# EAGLE design Driver (EAGLE 6.4)
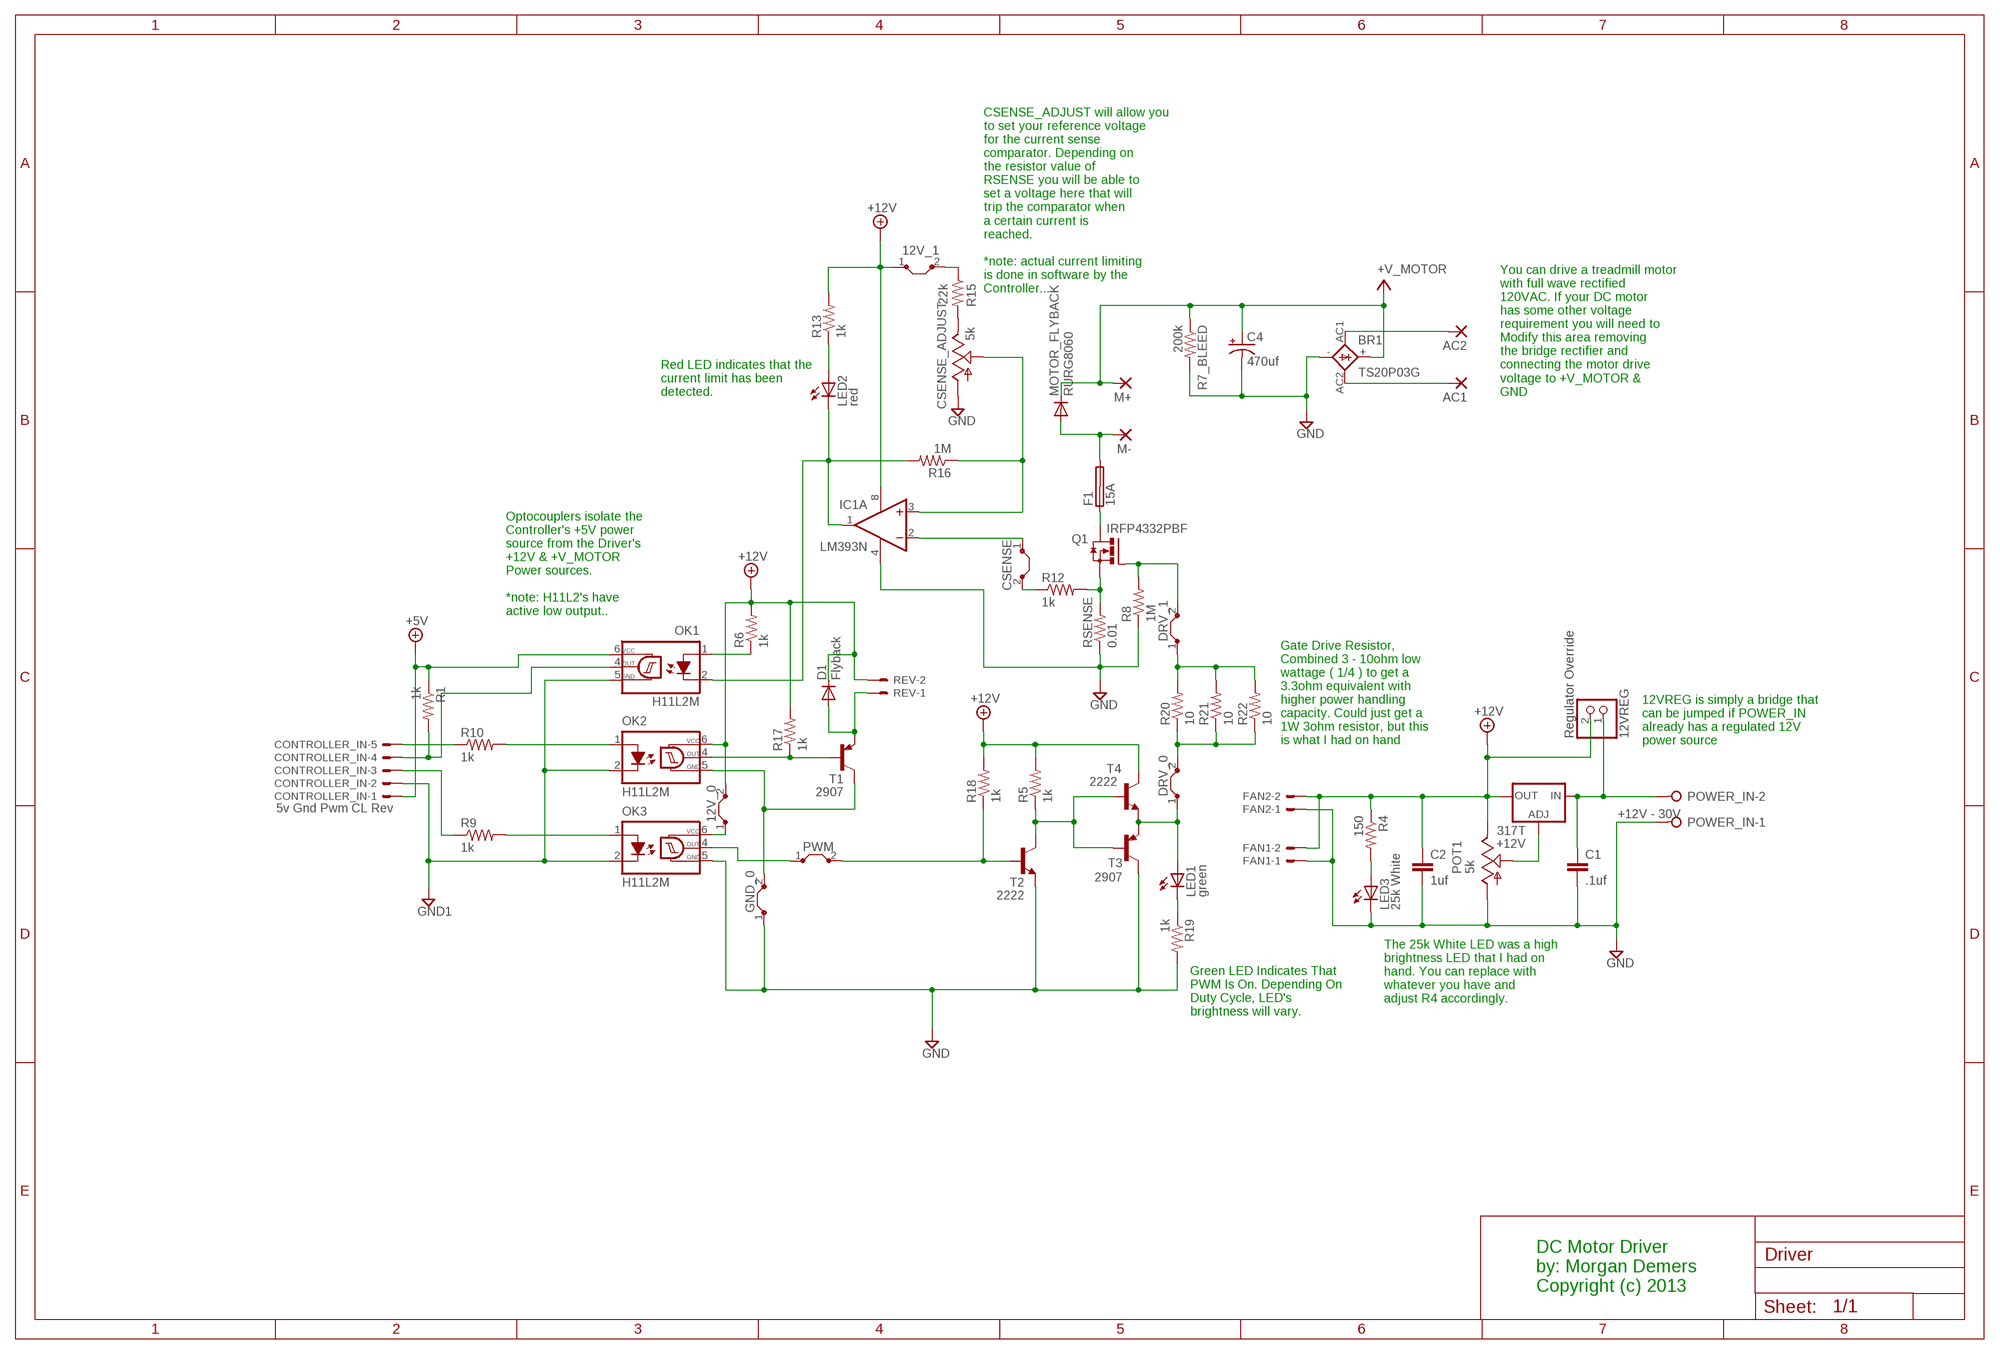
[diagram p0: schematic, sheet 1]

## Parts
12V_0  J10MM  [10]
12V_1  J5MM  [05]
12VREG  Regulator Override  PINHD-1X2  [1X02]
317T  +12V  LM317TS  [317TS]
AC1  WIREPAD4,16O1,6  [4,16O1,6]
AC2  WIREPAD4,16O1,6  [4,16O1,6]
BR1  TS20P03G  FB32  [FB32]
C1  .1uf  C2,5-3  [C2.5-3]
C2  1uf  C2,5-3  [C2.5-3]
C4  470uf  CPOL-USE10-22.5  [EB22,5D]
CONTROLLER_IN  5v Gnd Pwm CL Rev  22-23-2051  [22-23-2051]
CSENSE  J7MM  [07]
CSENSE_ADJUST  5k  TRIM_US-B25P  [B25P]
D1  Flyback  DIODE-D-2.5  [D-2.5]
DRV_0  J5MM  [05]
DRV_1  J12MM  [12]
F1  15A  SHK20L  [SHK20L]
FAN1  22-23-2021  [22-23-2021]
FAN2  22-23-2021  [22-23-2021]
GND_0  J7MM  [07]
IC1  LM393N  [DIL08]
LED1  green  LED3MM  [LED3MM]
LED2  red  LED3MM  [LED3MM]
LED3  25k White  LED3MM  [LED3MM]
M+  WIREPAD4,16O1,6  [4,16O1,6]
M-  WIREPAD4,16O1,6  [4,16O1,6]
MOTOR_FLYBACK  RURG8060  DIODE-TO220V  [TO220ACS]
OK1  H11L2M  [DIL06]
OK2  H11L2M  [DIL06]
OK3  H11L2M  [DIL06]
POT1  5k  TRIM_US-B25P  [B25P]
POWER_IN  +12V - 30V  W237-02P  [W237-132]
PWM  J5MM  [05]
Q1  IRFP4332PBF  IRFP240  [TO247BV]
R1  1k  R-US_0204/7  [0204/7]
R4  150  R-US_0204/2V  [0204V]
R5  1k  R-US_0204/2V  [0204V]
R6  1k  R-US_0204/2V  [0204V]
R7_BLEED  200k  R-US_0207/10  [0207/10]
R8  1M  R-US_0204/2V  [0204V]
R9  1k  R-US_0204/2V  [0204V]
R10  1k  R-US_0204/2V  [0204V]
R12  1k  R-US_0204/2V  [0204V]
R13  1k  R-US_0204/2V  [0204V]
R15  22k  R-US_0204/2V  [0204V]
R16  1M  R-US_0204/5  [0204/5]
R17  1k  R-US_0204/5  [0204/5]
R18  1k  R-US_0204/7  [0204/7]
R19  1k  R-US_0204/2V  [0204V]
R20  10  R-US_0204/2V  [0204V]
R21  10  R-US_0204/2V  [0204V]
R22  10  R-US_0204/2V  [0204V]
REV  22-23-2021  [22-23-2021]
RSENSE  0.01  R-US_0204/2V  [0204V]
T1  2907  MPSA56  [TO92-CBE]
T2  2222  -NPN-TO92-EBC  [TO92-EBC]
T3  2907  MPSA56  [TO92-CBE]
T4  2222  -NPN-TO92-EBC  [TO92-EBC]

## Nets
+5V: CONTROLLER_IN.1 OK1.6(VCC) R1.1
+12V: 12V_0.2 12V_1.1 12VREG.2 317T.2(OUT) C2.1 D1.C FAN1.2 FAN2.2 IC1.8(P:V+) OK2.6(VCC) POT1.E R4.1 R5.2 R6.2 R13.2 R17.2 R18.2 REV.2 T4.C
GND: BR1.- C1.2 C2.2 C4.- CSENSE_ADJUST.A FAN1.1 FAN2.1 GND_0.1 IC1.4(P:V-) LED3.K(C) OK3.5(GND) POT1.A POWER_IN.1 R7_BLEED.2 R8.1 R19.2 RSENSE.1 T2.E T3.C
GND1: CONTROLLER_IN.2 OK1.5(GND) OK2.2(C) OK3.2(C)
N$1: OK2.1(A) R10.2
N$2: OK3.4(OUT) PWM.1
N$3: CSENSE.1 IC1.2(A:-IN)
S$1: CONTROLLER_IN.3 R9.1
S$2: PWM.2 R18.1 T2.B
S$4: Q1.S R12.2 RSENSE.2
S$6: 317T.1(ADJ) POT1.S
S$7: CONTROLLER_IN.5 R10.1
S$8: CONTROLLER_IN.4 OK1.4(OUT) R1.2
S$9: R5.1 T2.C T3.B T4.B
S$10: 12V_1.2 R15.1
S$11: LED3.A R4.2
S$12: IC1.1(A:OUT) LED2.K(C) OK1.2(C) R16.2
S$13: DRV_0.2 R20.1 R21.1 R22.1
S$14: OK2.4(OUT) R17.1 T1.B
S$16: DRV_1.2 Q1.G R8.2
S$20: F1.1A Q1.D
S$21: AC1.1(P) BR1.AC2
S$22: OK1.1(A) R6.1
S$23: AC2.1(P) BR1.AC1
S$25: F1.2A M-.1(P) MOTOR_FLYBACK.A
S$26: 12V_0.1 OK3.6(VCC)
S$27: CSENSE_ADJUST.E R15.2
S$32: OK3.1(A) R9.2
S$34: CSENSE.2 R12.1
S$45: CSENSE_ADJUST.S IC1.3(A:+IN) R16.1
S$50: LED1.K(C) R19.1
S$51: LED2.A R13.1
S$52: DRV_1.1 R20.2 R21.2 R22.2
S$54: 12VREG.1 317T.3(IN) C1.1 POWER_IN.2
S$129: DRV_0.1 LED1.A T3.E T4.E
S$171: D1.A REV.1 T1.E
S$448: GND_0.2 OK2.5(GND) T1.C
V+: BR1.+ C4.+ M+.1(P) MOTOR_FLYBACK.C R7_BLEED.1 ; supply symbol labelled +V_MOTOR
Unconnected: F1.1B F1.2B IC1.5(B:+IN) IC1.6(B:-IN) IC1.7(B:OUT)

## Notes on the sheet
- CSENSE_ADJUST will allow you
  to set your reference voltage
  for the current sense 
  comparator. Depending on
  the resistor value of 
  RSENSE you will be able to
  set a voltage here that will
  trip the comparator when
  a certain current is 
  reached.
  
  *note: actual current limiting
  is done in software by the
  Controller...
- Red LED indicates that the
  current limit has been 
  detected.
- You can drive a treadmill motor
  with full wave rectified
  120VAC. If your DC motor
  has some other voltage 
  requirement you will need to
  Modify this area removing
  the bridge rectifier and 
  connecting the motor drive
  voltage to +V_MOTOR &
  GND
- Optocouplers isolate the
  Controller's +5V power 
  source from the Driver's
  +12V & +V_MOTOR
  Power sources.
  
  *note: H11L2's have 
  active low output..
- Gate Drive Resistor,
  Combined 3 - 10ohm low
  wattage ( 1/4 ) to get a
  3.3ohm equivalent with
  higher power handling
  capacity. Could just get a
  1W 3ohm resistor, but this
  is what I had on hand
- 12VREG is simply a bridge that
  can be jumped if POWER_IN
  already has a regulated 12V 
  power source
- The 25k White LED was a high
  brightness LED that I had on
  hand. You can replace with
  whatever you have and 
  adjust R4 accordingly.
- Green LED Indicates That
  PWM Is On. Depending On
  Duty Cycle, LED's
  brightness will vary.
- DC Motor Driver
  by: Morgan Demers
  Copyright (c) 2013

## Library data of the parts
12V_0 12V_1 CSENSE DRV_0 DRV_1 GND_0 PWM = jumper:J: Bridge
12VREG = pinhead:PINHD-1X2: PIN HEADER
317T = v-reg:LM317TS: VOLTAGE REGULATOR
AC1 AC2 M+ M- = wirepad:WIREPAD: Wire PAD connect wire on PCB
BR1 = rectifier:FB32: FAGOR RECTIFIER grid 1 x 10,2 x 7,5 mm
C1 C2 = capacitor-wima:C: CAPACITOR naming: grid - package width
C4 = rcl:CPOL-US: POLARIZED CAPACITOR, American symbol
CONTROLLER_IN = con-molex:22-23-2051: .100" (2.54mm) Center Header - 5 Pin; MF: MOLEX; MPN: 22-23-2051; OC_FARNELL: 1462952; OC_NEWARK: 38C9178
CSENSE_ADJUST POT1 = pot:TRIM_US-: POTENTIOMETER
D1 MOTOR_FLYBACK = diode:DIODE-: DIODE
F1 = fuse:SHK20L: FUSE HOLDER 5 x 20 mm, SH contact, SHH1 Schukat, E1073 Buerklin; OC_FARNELL: unknown; OC_NEWARK: unknown
FAN1 FAN2 REV = con-molex:22-23-2021: .100" (2.54mm) Center Header - 2 Pin; MF: MOLEX; MPN: 22-23-2021; OC_FARNELL: 1462926; OC_NEWARK: 25C3832
IC1 = linear:LM393: COMPARATOR
LED1-LED3 = led:LED: LED OSRAM: - CHIPLED LG R971, LG N971, LY N971, LG Q971, LY Q971, LO R971, LY R971 LH N974, LH R974 LS Q976, LO Q976, LY Q976 LO Q996 - Hyper CHIPLED LW Q18S LB Q993, LB Q99A, LB R99A - SideLED LS A670, LO A670, LY A670, LG A670, LP A670 LB A673, LV A673, LT A673, LW A673 LH A674 LY A675 LS A676, LA A676, LO A676, LY A676, LW A676 LS A679, LY A679, LG A679 - Hyper Micro SIDELED® LS Y876, LA Y876, LO Y876, LY Y876 LT Y87S - SmartLED LW L88C, LW L88S LB L89C, LB L89S, LG L890 LS L89K, LO L89K, LY L89K LS L896, LA L896, LO L896, LY L896 - TOPLED LS T670, LO T670, LY T670, LG T670, LP T670 LSG T670, LSP T670, LSY T670, LOP T670, LYG T670 LG T671, LOG T671, LSG T671 LB T673, LV T673, LT T673, LW T673 LH T674 LS T676, LA T676, LO T676, LY T676, LB T676, LH T676, LSB T676, LW T676 LB T67C, LV T67C, LT T67C, LS T67K, LO T67K, LY T67K, LW E67C LS E67B, LA E67B, LO E67B, LY E67B, LB E67C, LV E67C, LT E67C LW T67C LS T679, LY T679, LG T679 LS T770, LO T770, LY T770, LG T770, LP T770 LB T773, LV T773, LT T773, LW T773 LH T774 LS E675, LA E675, LY E675, LS T675 LS T776, LA T776, LO T776, LY T776, LB T776 LHGB T686 LT T68C, LB T68C - Hyper Mini TOPLED® LB M676 - Mini TOPLED Santana® LG M470 LS M47K, LO M47K, LY M47K Source: http://www.osram.convergy.de LUXEON: - LUMILED® LXK2-PW12-R00, LXK2-PW12-S00, LXK2-PW14-U00, LXK2-PW14-V00 LXK2-PM12-R00, LXK2-PM12-S00, LXK2-PM14-U00 LXK2-PE12-Q00, LXK2-PE12-R00, LXK2-PE12-S00, LXK2-PE14-T00, LXK2-PE14-U00 LXK2-PB12-K00, LXK2-PB12-L00, LXK2-PB12-M00, LXK2-PB14-N00, LXK2-PB14-P00, LXK2-PB14-Q00 LXK2-PR12-L00, LXK2-PR12-M00, LXK2-PR14-Q00, LXK2-PR14-R00 LXK2-PD12-Q00, LXK2-PD12-R00, LXK2-PD12-S00 LXK2-PH12-R00, LXK2-PH12-S00 LXK2-PL12-P00, LXK2-PL12-Q00, LXK2-PL12-R00 Source: www.luxeon.com KINGBRIGHT: KA-3528ASYC Source: www.kingbright.com
OK1-OK3 = optocoupler:H11L*M: 6-Pin DIP Optocoupler Source: http://www.fairchildsemi.com/ds/H1/H11L2-M.pdf; MF: FAIRCHILD SEMICONDUCTOR; MPN: H11L2M; OC_FARNELL: 1021231; OC_NEWARK: 72K8645
POWER_IN = con-wago-508:W237-02P: WAGO SREW CLAMP; OC_FARNELL: unknown; OC_NEWARK: unknown
Q1 = transistor-power:IRFP240: HEXFET Power MosFet Source: http://www.irf.com/
R1 R4-R6 R7_BLEED R8-R10 R12 R13 R15-R22 RSENSE = resistor:R-US_: RESISTOR, American symbol
T1 T3 = transistor-pnp:MPSA56*: PNP Transistror Source: http://www.fairchildsemi.com/ds/MM/MMBTA56.pdf
T2 T4 = transistor:*-NPN-: NPN Transistror BF959 corrected 2008.03.06

## Board
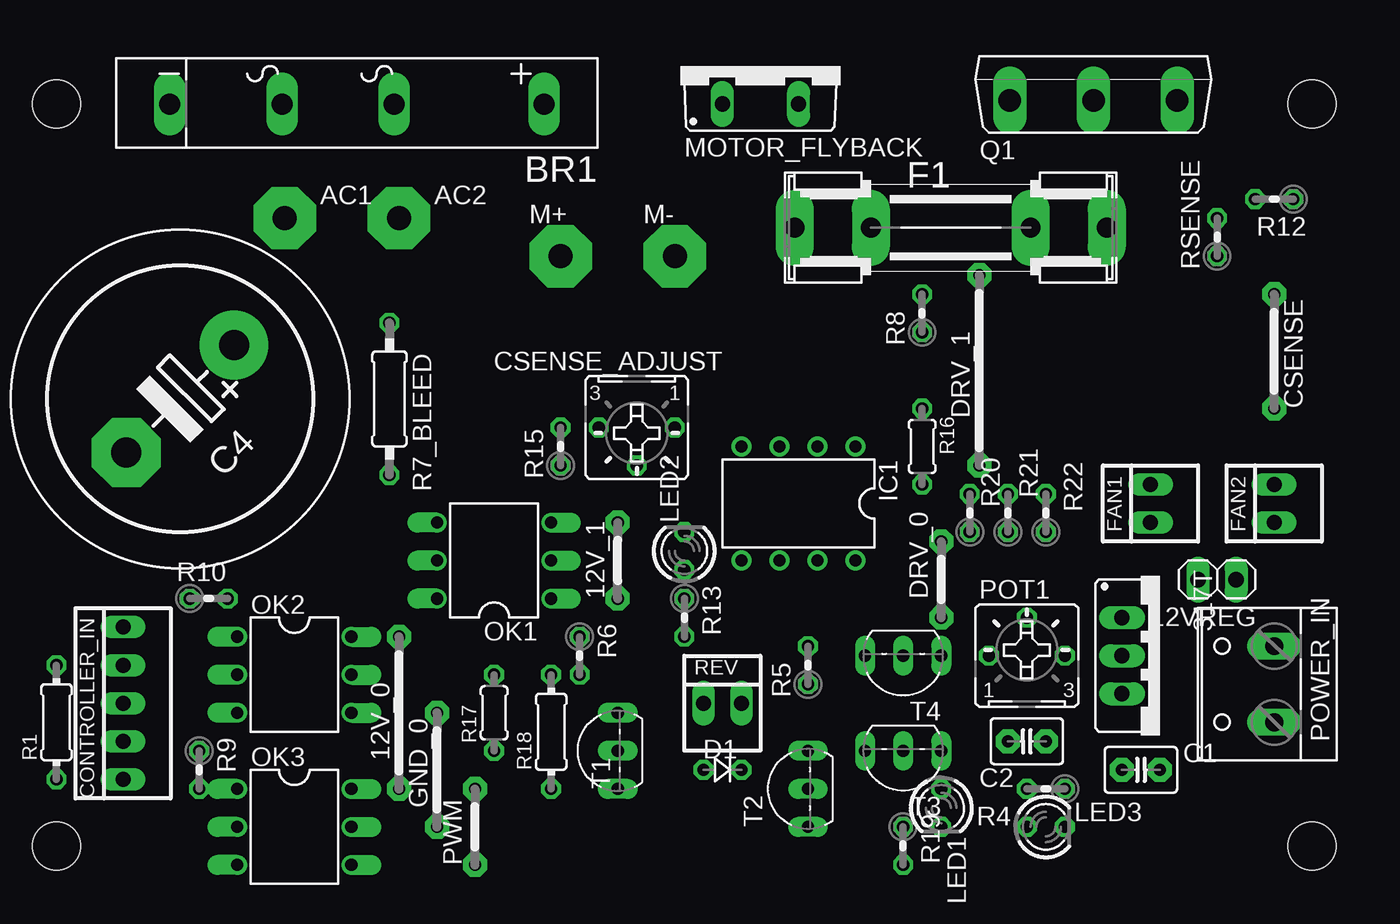
[diagram p1: board, top side]
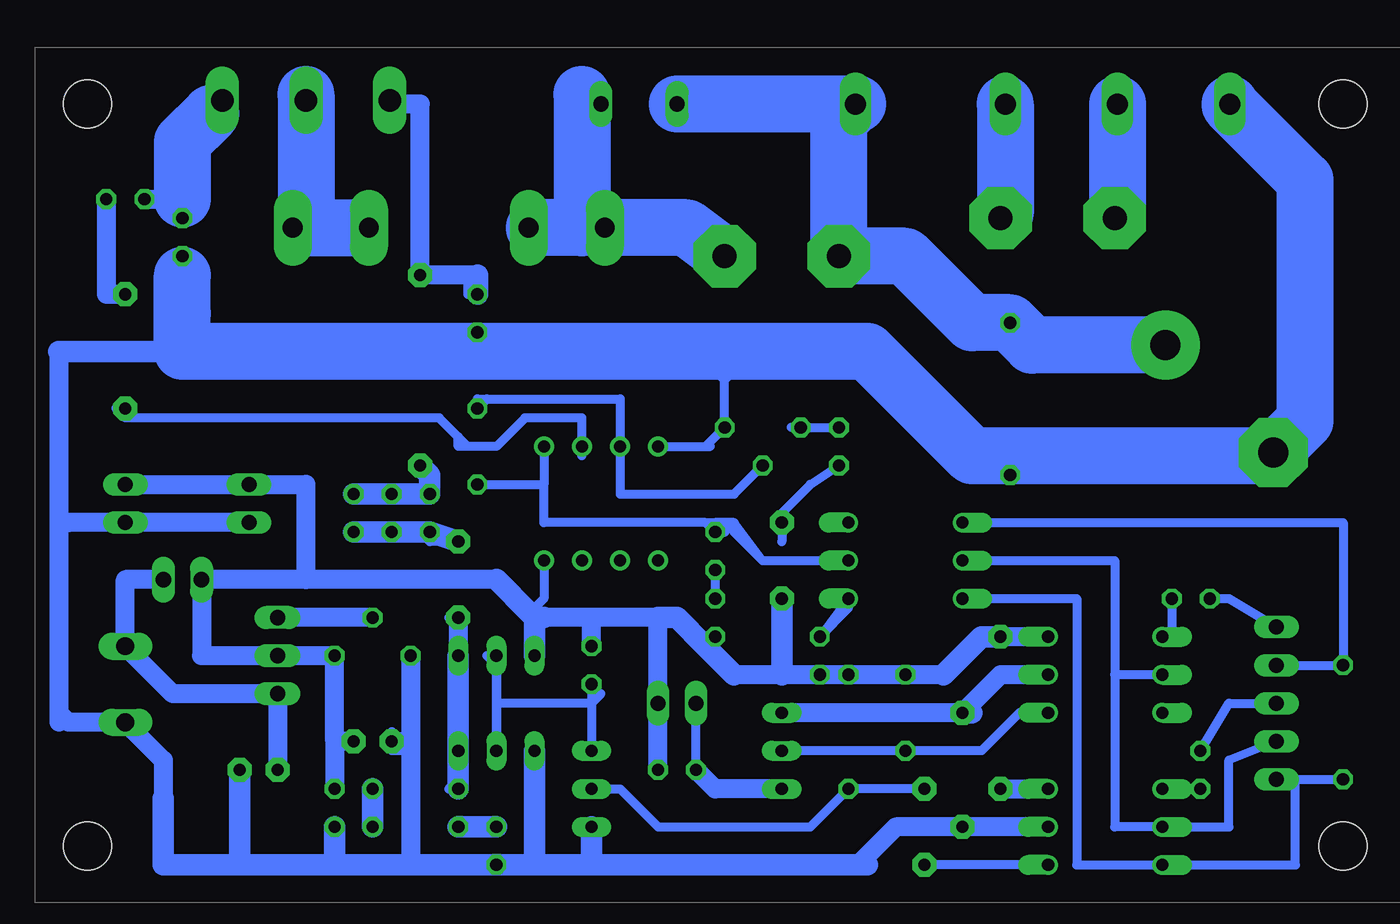
[diagram p2: board, bottom side, seen from below]

No outline drawn. Coordinates in mm, seen from the top.
Copper layers (1*16): Top 0.035mm / dielectric 1.5mm / Bottom 0.035mm
Design rules "default": minimum track width 10mil, minimum drill 24mil, track to track 12mil, track to pad 12mil, pad to pad 12mil, via to via 12mil, smd to smd 8mil, copper to edge 40mil, drill to drill 8mil, minimum pad ring 10mil, minimum via ring 8mil, stop-mask expansion 4mil, vias tented up to drill 0mil, thermal gap 10mil
Holes 3.2 mm at 3.81,53.34 87.63,53.34 87.63,3.81 3.81,3.81

### Footprints (pad centres in the part's own frame; a part is rotated, then mirrored left to right if it is on the bottom)
10 = drill 0.813 pad 1.6 octagon: 1 -5.08,0; 2 5.08,0
05 = drill 0.813 pad 1.6 octagon: 1 -2.54,0; 2 2.54,0
1X02 = drill 1.016 long: 1 -1.27,0; 2 1.27,0
317TS = drill 1.016 long: 1 -2.54,-2.54; 2 0,-2.54; 3 2.54,-2.54
4,16O1,6 = drill 1.6 pad 4.166 octagon: 1 0,0
FB32 = drill 1.397 long: + -13.5,0; - 11.494,0; AC1 -3.492,0; AC2 4.001,0
C2.5-3 = drill 0.813 pad 1.6 octagon: 1 -1.27,0; 2 1.27,0
EB22,5D = drill 2.007 pad 4.597: + -5.08,0 | drill 2.007 pad 4.597 octagon: - 5.08,0
22-23-2051 = drill 1 long: 1 -5.08,0; 2 -2.54,0; 3 0,0; 4 2.54,0; 5 5.08,0
07 = drill 0.813 pad 1.6 octagon: 1 -3.81,0; 2 3.81,0
B25P = drill 0.813 octagon: A -2.54,0; E 2.54,0; S 0,2.54
D-2.5 = drill 0.813 octagon: A 1.27,0; C -1.27,0
12 = drill 0.813 pad 1.6 octagon: 1 -6.35,0; 2 6.35,0
SHK20L = drill 1.321 pad 2.54 long: 1A -10.414,0; 1B -5.334,0; 2A 10.414,0; 2B 5.334,0
22-23-2021 = drill 1 long: 1 -1.27,0; 2 1.27,0
DIL08 = drill 0.813 pad 1.27: 1 -3.81,-3.81; 2 -1.27,-3.81; 3 1.27,-3.81; 4 3.81,-3.81; 5 3.81,3.81; 6 1.27,3.81; 7 -1.27,3.81; 8 -3.81,3.81
LED3MM = drill 0.813 octagon: A -1.27,0; K 1.27,0
TO220ACS = drill 1.016 long: A 2.54,-2.54; C -2.54,-2.54
DIL06 = drill 0.813 offset: 1 -2.54,-3.81; 2 0,-3.81; 3 2.54,-3.81; 4 2.54,3.81; 5 0,3.81; 6 -2.54,3.81
W237-132 = drill 1.194 long: 1 -2.54,-0.635; 2 2.54,-0.635
TO247BV = drill 1.499 long: D 0,-2.921; G -5.588,-2.921; S 5.588,-2.921
0204/7 = drill 0.813 octagon: 1 -3.81,0; 2 3.81,0
0204V = drill 0.813 octagon: 1 -1.27,0; 2 1.27,0
0207/10 = drill 0.813 octagon: 1 -5.08,0; 2 5.08,0
0204/5 = drill 0.813 octagon: 1 -2.54,0; 2 2.54,0
TO92-CBE = drill 0.813 long: B 0,0; C 2.54,0; E -2.54,0
TO92-EBC = drill 0.813 long: B 0,-1.27; C 2.54,-1.27; E -2.54,-1.27

### Placement (x,y rotation side)
12V_0  26.67,12.7 90 top
12V_1  41.27,22.86 90 top
12VREG  81.28,21.59 180 top
317T  77.47,16.51 270 top
AC1  19.05,45.72 0 top
AC2  26.67,45.72 0 top
BR1  22.86,53.34 180 top
C1  76.2,8.89 0 top
C2  68.58,10.79 180 top
C4  12.06,33.66 225 top
CONTROLLER_IN  8.26,13.34 90 top
CSENSE  85.09,36.83 90 top
CSENSE_ADJUST  42.55,31.75 180 top
D1  48.26,8.89 180 top
DRV_0  62.87,21.59 90 top
DRV_1  65.41,35.56 90 top
F1  63.5,45.09 180 top
FAN1  76.83,26.67 90 top
FAN2  85.09,26.67 90 top
GND_0  29.21,8.89 90 top
IC1  53.34,26.67 180 top
LED1  62.87,6.35 270 top
LED2  45.72,23.5 90 top
LED3  69.85,5.08 0 top
M+  37.47,43.18 0 top
M-  45.09,43.18 0 top
MOTOR_FLYBACK  50.8,55.88 0 top
OK1  33.02,22.86 90 top
OK2  19.68,15.24 270 top
OK3  19.68,5.08 270 top
POT1  68.58,16.51 0 top
POWER_IN  84.45,14.61 90 top
PWM  31.75,5.08 90 top
Q1  73.03,56.52 0 top
R1  3.81,12.06 90 top
R4  69.85,7.62 180 top
R5  53.98,15.88 90 top
R6  38.73,16.51 270 top
R7_BLEED  26.04,33.66 270 top
R8  61.59,39.37 90 top
R9  13.34,8.89 270 top
R10  13.97,20.32 0 top
R12  85.09,46.99 180 top
R13  45.72,19.05 270 top
R15  37.47,30.48 90 top
R16  61.59,30.48 270 top
R17  33.02,12.7 90 top
R18  36.83,11.43 90 top
R19  60.33,3.81 270 top
R20  64.77,26.04 90 top
R21  67.31,26.04 90 top
R22  69.85,26.04 90 top
REV  48.26,13.34 0 top
RSENSE  81.28,44.45 90 top
T1  41.27,10.16 90 top
T2  52.7,7.62 90 top
T3  60.33,10.16 180 top
T4  60.33,15.24 180 top

### Tracks (layer width: path | path; a pad name or v marks a point on that pad's centre or on a via)
+5V
  Bottom 0.61: CONTROLLER_IN.1 6.99,8.26 | OK1.6 21.59,20.32 21.59,2.54 6.99,2.54 6.99,8.26 | 6.99,8.26 R1.1
+12V
  Bottom 0.61: 46.35,17.14 R13.2 | T4.C 57.78,18.41 57.15,19.05 | IC1.8 57.15,20.32 58.1,19.37
  Bottom 1.27: 30.48,15.24 R17.2 R18.2 R6.2 41.27,15.24 44.45,15.24 | 53.98,19.05 49.53,19.05 REV.2 D1.C | 53.98,19.05 57.15,19.05 | R5.2 53.98,19.05 | 60.33,21.59 73.03,21.59 | 85.72,27.94 FAN2.2 FAN1.2 73.03,27.94 73.03,21.59 | 73.03,21.59 12VREG.2 80.01,16.51 317T.2 POT1.E 71.12,10.79 | 71.12,10.79 R4.1 | C2.1 71.12,10.79 | OK2.6 12V_0.2
  Bottom 1.422: 57.15,19.05 57.78,19.05 | 57.78,19.05 T4.C | 60.33,21.59 58.1,19.37 57.78,19.05 | 30.48,15.24 27.94,17.78 12V_0.2 | 41.27,15.24 12V_1.1 | 49.53,19.05 48.26,19.05 46.35,17.14 44.45,15.24
-V_MOTOR
  Bottom 3.81: 54.61,53.98 54.61,45.09 | 54.61,45.09 57.78,45.09 | 45.09,43.18 47.62,45.09 54.61,45.09
GND
  Bottom 0.406: 46.04,30.48 46.04,30.8
  Bottom 0.61: C4.- 8.67,30.06 8.89,29.84 | R7_BLEED.2 27.3,28.57 28.57,29.84 | R8.1 60.96,38.1 59.69,36.83 | RSENSE.1 81.28,39.37 | 89.53,25.4 FAN2.1 FAN1.1 | CSENSE_ADJUST.A 45.09,36.83 | 45.09,34.92 45.72,35.56 | 66.04,10.16 67.31,10.16 67.31,11.43 66.04,10.16 | 66.04,10.16 66.04,15.24 | CSENSE_ADJUST.A 45.09,34.92 | 45.09,34.92 44.45,35.56 44.45,36.83 | T2.E 53.98,3.17 53.34,2.54 58.42,2.54 | T3.C 57.78,3.17 58.42,2.54 | 58.42,2.54 60.96,2.54 | 46.35,30.48 46.04,30.8 CSENSE_ADJUST.A | IC1.4 46.04,30.48
  Bottom 1.27: 89.53,36.83 89.53,25.4 89.53,12.7 | 89.53,12.7 89.53,12.06 | 89.53,12.7 88.9,12.06 POWER_IN.1 82.55,9.53 82.55,6.35 | 36.2,2.54 33.66,5.08 GND_0.1 OK3.5 | POT1.A 66.04,15.24 66.04,10.79 | 66.04,10.79 66.04,10.16 66.04,2.54 | C2.2 66.04,10.79
  Bottom 1.422: 77.47,2.54 82.55,2.54 82.55,6.35 82.55,6.99 | 77.47,2.54 71.12,2.54 | 71.12,2.54 66.04,2.54 60.96,2.54 R19.2 58.42,2.54 57.78,2.54 | 57.78,2.54 53.98,2.54 | 53.98,2.54 53.34,2.54 36.2,2.54 35.56,2.54 | T2.E 53.98,2.54 | C1.2 77.47,2.54 | LED3.K 71.12,2.54 | 89.53,36.83 81.28,36.83 | T3.C 57.78,2.54
  Bottom 3.81: 81.28,41.91 81.28,39.37 81.28,36.83 59.69,36.83 44.45,36.83 35.56,36.83 28.57,29.84 8.89,29.84 8.26,29.84 | BR1.- 11.37,53.28 6.35,48.26 6.35,32.19 C4.-
GND1
  Bottom 0.61: 19.05,15.24 19.05,22.86 OK1.5 | 19.05,15.24 19.05,5.08 OK3.2 11.43,5.08 11.43,9.53 CONTROLLER_IN.2 | OK2.2 19.05,15.24
N$1
  Bottom 0.61: R10.2 15.24,17.78 OK2.1
N$2
  Bottom 0.61: OK3.4 PWM.1
N$3
  Bottom 0.61: IC1.2 54.61,32.38 58.42,32.38 60.33,30.48 62.87,30.48 62.87,31.11 64.14,32.38 84.45,32.38 CSENSE.1
S$1
  Bottom 0.61: R9.1 11.43,13.34 CONTROLLER_IN.3
S$2
  Bottom 0.61: PWM.2 R18.1 39.37,5.08 49.53,5.08 52.07,7.62 T2.B
S$4
  Bottom 0.61: Q1.S 78.61,53.47 81.28,50.8 81.28,46.99 | 81.28,46.99 RSENSE.2 | R12.2 81.28,46.99
  Bottom 1.27: R12.2 82.55,46.99
S$5
  Bottom 1.27: 76.2,25.4 88.9,25.4
S$6
  Bottom 1.27: POT1.S 317T.1
S$7
  Bottom 0.61: R10.1 11.43,20.32 CONTROLLER_IN.5
S$8
  Bottom 0.61: CONTROLLER_IN.4 R1.2 3.81,25.4 OK1.4
S$9
  Bottom 0.61: 53.98,13.34 60.33,13.34 | 60.33,13.34 T4.B 60.33,10.79 | 60.33,13.34 T3.B 60.33,15.88 60.96,16.51 | 53.98,13.34 53.34,13.97 | 53.98,13.34 T2.C | R5.1 53.98,13.34
S$10
  Bottom 0.61: 12V_1.2 41.27,26.04 39.37,27.94 R15.1
S$11
  Bottom 1.422: R4.2 LED3.A
S$12
  Bottom 0.61: LED2.K 45.09,24.77 44.45,25.4 | 44.45,25.4 43.18,23.5 | 43.18,23.5 42.55,22.86 | 42.55,22.86 44.45,25.4 | 44.45,25.4 45.72,25.4 | 57.15,27.94 57.15,25.4 46.35,25.4 | 45.72,25.4 LED2.K | LED2.K 46.35,25.4 | R16.2 57.15,27.94 | IC1.1 57.15,27.94 | 46.35,25.4 45.72,25.4 | 44.45,25.4 44.45,24.77 43.18,23.5 | 42.55,22.86 OK1.2
S$13
  Bottom 0.61: 64.77,24.13 R20.1 63.5,24.77 DRV_0.2 64.77,24.13 | 64.77,24.13 65.41,24.77
  Bottom 1.422: DRV_0.2 R20.1 65.41,24.77 R21.1 R22.1
S$14
  Bottom 0.61: T1.B R17.1 27.94,10.16 25.4,12.7 OK2.4
S$16
  Bottom 0.61: DRV_1.2 65.41,52.7 66.04,53.34 66.29,53.59 Q1.G | 62.23,41.91 62.23,40.64
  Bottom 1.27: 61.59,41.91 62.23,41.91 DRV_1.2 65.41,53.34 66.04,53.34 67.94,53.34
  Bottom 1.422: 61.59,41.91 R8.2
S$17
  Bottom 0.61: 41.27,26.04 41.27,24.13
S$18
  Bottom 3.81: 79.38,52.7 81.28,50.8 81.28,46.99
S$19
  Bottom 3.81: 73.03,53.98 73.03,45.09 69.85,45.09
S$20
  Bottom 0.61: F1.1A 73.91,52.7 Q1.D
S$21
  Bottom 3.81: BR1.AC2 18.86,45.91 AC1.1
S$22
  Bottom 0.61: OK1.1 R6.1 36.83,19.68 OK1.1
S$23
  Bottom 3.81: BR1.AC1 26.35,46.04 AC2.1
S$25
  Bottom 0.61: M-.1 46.99,45.09 F1.2A 53.09,53.09 MOTOR_FLYBACK.A
S$26
  Bottom 1.27: 12V_0.1 OK3.6
S$27
  Bottom 0.61: 40.64,31.75 CSENSE_ADJUST.E R15.2
S$32
  Bottom 0.61: R9.2 OK3.1
S$34
  Bottom 1.27: R12.1 86.36,40.64 CSENSE.2
S$41
  Bottom 0.61: 54.61,29.84 54.61,32.38 58.42,32.38 60.33,30.48 62.23,30.48 64.14,32.38 85.09,32.38 85.72,33.02
S$45
  Bottom 0.61: CSENSE_ADJUST.S 44.45,27.3 52.07,27.3 IC1.3 52.07,33.66 60.96,33.66 | 61.59,33.66 60.96,33.66 | R16.1 60.96,33.66
S$50
  Bottom 1.422: R19.1 LED1.K
S$51
  Bottom 0.61: LED2.A 45.72,20.95 R13.1
S$52
  Bottom 1.422: R22.2 R21.2 R20.2 64.77,28.57 DRV_1.1
S$54
  Bottom 1.27: 12VREG.1 85.09,21.59 POWER_IN.2 81.92,13.97 317T.3 C1.1
S$129
  Bottom 0.61: T4.E 62.87,18.41 63.5,19.05 | T3.E 62.87,8.26 63.5,7.62
  Bottom 1.27: DRV_0.1 T4.E
  Bottom 1.422: T4.E T3.E LED1.A
S$171
  Bottom 0.61: D1.A REV.1
  Bottom 1.27: D1.A 45.72,7.62 T1.E
S$448
  Bottom 1.27: T1.C GND_0.2 26.67,15.24 OK2.5
  Bottom 1.422: GND_0.2 28.57,12.7
V+
  Bottom 3.81: C4.+ 24.55,37.25 R7_BLEED.1 28.57,38.73 33.02,43.18 M+.1 37.47,52.23 BR1.+ | 36.2,53.34 BR1.+ | BR1.+ MOTOR_FLYBACK.C

### Text on the board
tDocu: 120VAC IN | Treadmill | Motor Output | Motor Driver v4 | by Morgan Demers